# Altium schematic sheet base_board.SchDoc
size A4
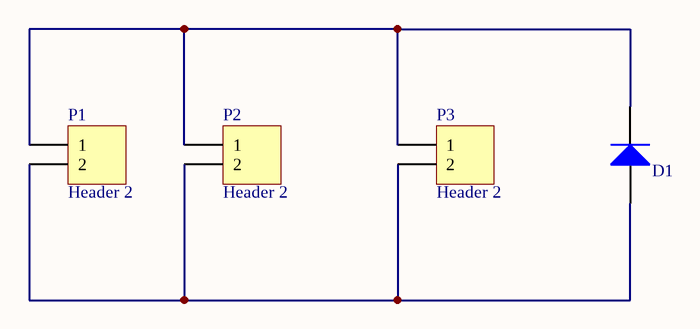
[diagram p0: base_board.SchDoc]

## Parts
D1  D Diode  [0805_M_POL]  (value not drawn)
P1  Header 2  [HDR1X2]
P2  Header 2  [HDR1X2]
P3  Header 2  [HDR1X2]

## Nets
NetD1_1: D1.1(A) P1.2 P2.2 P3.2
NetD1_2: D1.2(K) P1.1 P2.1 P3.1

## Library data of the parts
P1-P3 = Header 2: Header, 2-Pin; LatestRevisionDate: 17-Jul-2002; LatestRevisionNote: Re-released for DXP Platform.; Publisher: Altium Limited
D1 = D Diode: Supplier 1: Digikey